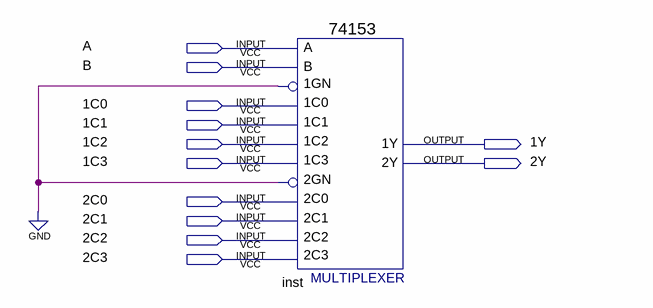
[diagram p0: schematic sheet]
// Quartus schematic 74153_only.bdf as structural Verilog: 1 symbols, 12 pins
module \74153_only  (
  input  A,
  input  B,
  input  \1C0 ,
  input  \1C1 ,
  input  \1C2 ,
  input  \1C3 ,
  input  \2C0 ,
  input  \2C1 ,
  input  \2C2 ,
  input  \2C3 ,
  output \1Y ,
  output \2Y 
);

  \74153  inst (
    .\1C1 (\1C1 ), .\1GN (1'b0), .\1C0 (\1C0 ), .\2C0 (\2C0 ), .\2GN (1'b0), .\2C2 (\2C2 ), .\1C2 (\1C2 ),
    .\1C3 (\1C3 ), .B(B), .A(A), .\2C1 (\2C1 ), .\2C3 (\2C3 ), .\1Y (\1Y ), .\2Y (\2Y ));
endmodule
